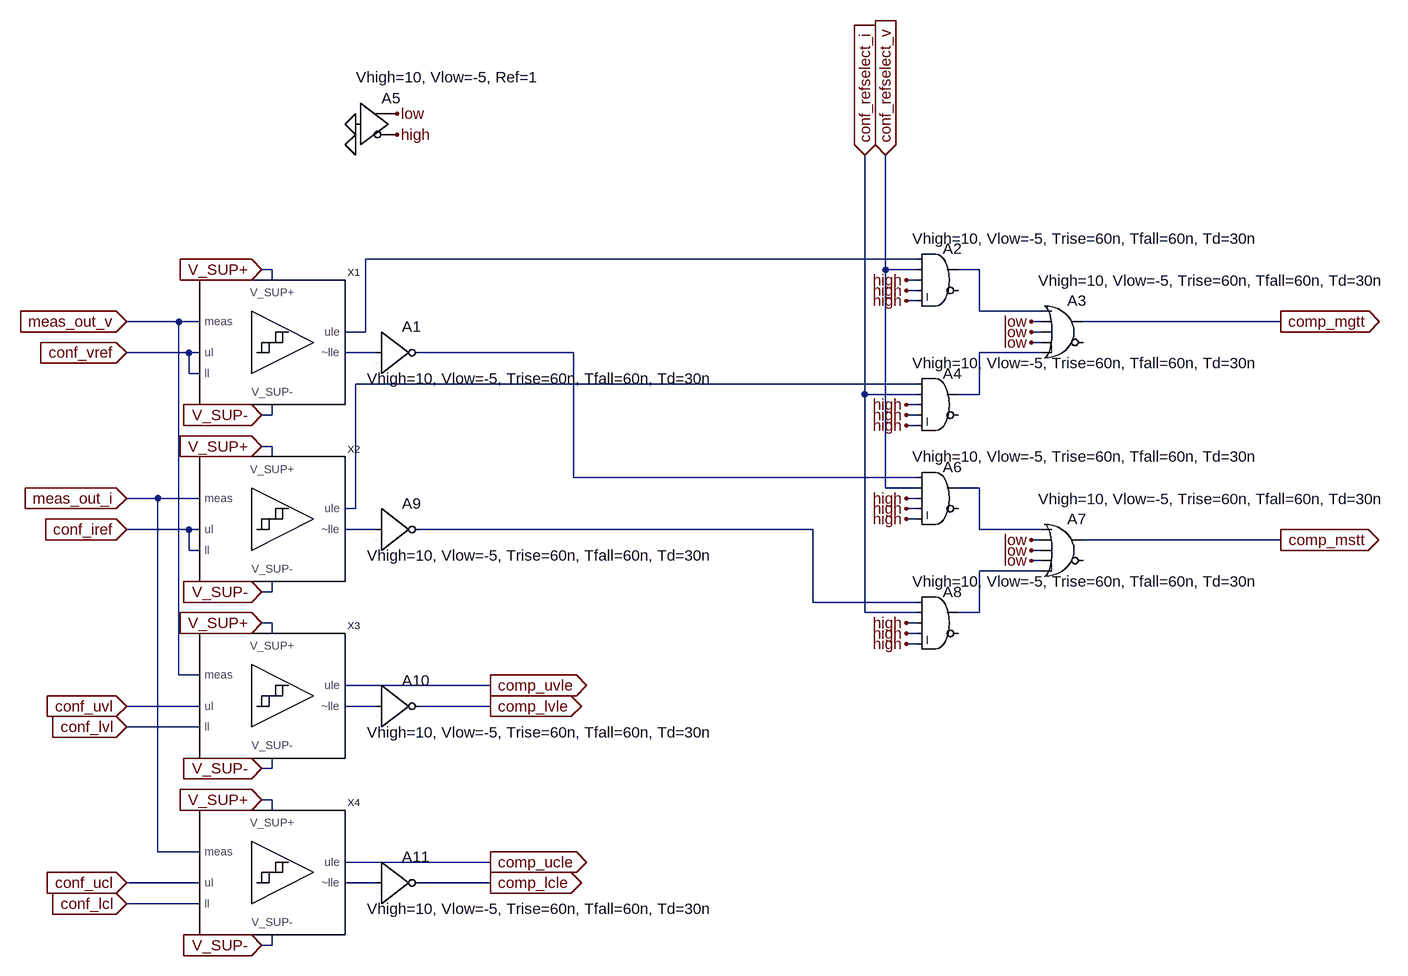
[diagram p0: schematic compare-logic.asc]
compare-logic.asc, the LTspice schematic file:
Version 4
SHEET 1 1856 856
WIRE 960 -272 112 -272
WIRE -32 -256 -48 -256
WIRE 912 -256 912 -432
WIRE 960 -256 912 -256
WIRE 1056 -256 1024 -256
WIRE -32 -240 -32 -256
WIRE 960 -240 944 -240
WIRE 960 -224 944 -224
WIRE 960 -208 944 -208
WIRE 1056 -192 1056 -256
WIRE 1152 -192 1056 -192
WIRE -176 -176 -256 -176
WIRE -144 -176 -176 -176
WIRE 1152 -176 1136 -176
WIRE 1520 -176 1216 -176
WIRE 112 -160 112 -272
WIRE 112 -160 80 -160
WIRE 1152 -160 1136 -160
WIRE 1152 -144 1136 -144
WIRE -160 -128 -256 -128
WIRE -144 -128 -160 -128
WIRE 128 -128 80 -128
WIRE 432 -128 192 -128
WIRE 1152 -128 1056 -128
WIRE -160 -96 -160 -128
WIRE -144 -96 -160 -96
WIRE 960 -80 96 -80
WIRE 880 -64 880 -432
WIRE 960 -64 880 -64
WIRE 1056 -64 1056 -128
WIRE 1056 -64 1024 -64
WIRE 960 -48 944 -48
WIRE -32 -32 -32 -48
WIRE -32 -32 -48 -32
WIRE 960 -32 944 -32
WIRE 960 -16 944 -16
WIRE -32 16 -48 16
WIRE -32 32 -32 16
WIRE 432 64 432 -128
WIRE 960 64 432 64
WIRE 912 80 912 -256
WIRE 960 80 912 80
WIRE 1056 80 1024 80
WIRE -208 96 -256 96
WIRE -144 96 -208 96
WIRE 960 96 944 96
WIRE 96 112 96 -80
WIRE 96 112 80 112
WIRE 960 112 944 112
WIRE 960 128 944 128
WIRE -160 144 -256 144
WIRE -144 144 -160 144
WIRE 128 144 80 144
WIRE 800 144 192 144
WIRE 1056 144 1056 80
WIRE 1152 144 1056 144
WIRE 1152 160 1136 160
WIRE 1520 160 1216 160
WIRE -160 176 -160 144
WIRE -144 176 -160 176
WIRE 1152 176 1136 176
WIRE 1152 192 1136 192
WIRE 1152 208 1056 208
WIRE -32 240 -32 224
WIRE -32 240 -48 240
WIRE 800 256 800 144
WIRE 960 256 800 256
WIRE 880 272 880 -64
WIRE 960 272 880 272
WIRE 1056 272 1056 208
WIRE 1056 272 1024 272
WIRE -32 288 -48 288
WIRE 960 288 944 288
WIRE -32 304 -32 288
WIRE 960 304 944 304
WIRE 960 320 944 320
WIRE -176 368 -176 -176
WIRE -144 368 -176 368
WIRE 304 384 80 384
WIRE -144 416 -256 416
WIRE 128 416 80 416
WIRE 304 416 192 416
WIRE -144 448 -256 448
WIRE -32 512 -32 496
WIRE -32 512 -48 512
WIRE -32 560 -48 560
WIRE -32 576 -32 560
WIRE -208 640 -208 96
WIRE -144 640 -208 640
WIRE 304 656 80 656
WIRE -144 688 -256 688
WIRE 128 688 80 688
WIRE 304 688 192 688
WIRE -144 720 -256 720
WIRE -32 784 -32 768
WIRE -32 784 -48 784
FLAG 96 -448 0
FLAG 96 -480 0
FLAG 160 -464 high
FLAG 160 -496 low
FLAG 944 -240 high
FLAG 944 -224 high
FLAG 944 -208 high
FLAG 1136 -160 low
FLAG 1136 -144 low
FLAG 1136 -176 low
FLAG 944 -48 high
FLAG 944 -32 high
FLAG 944 -16 high
FLAG 912 -432 conf_refselect_v
IOPIN 912 -432 In
FLAG 880 -432 conf_refselect_i
IOPIN 880 -432 In
FLAG 944 96 high
FLAG 944 112 high
FLAG 944 128 high
FLAG 1136 176 low
FLAG 1136 192 low
FLAG 1136 160 low
FLAG 944 288 high
FLAG 944 304 high
FLAG 944 320 high
FLAG -48 -256 V_SUP+
IOPIN -48 -256 In
FLAG -48 -32 V_SUP-
IOPIN -48 -32 In
FLAG -48 16 V_SUP+
IOPIN -48 16 In
FLAG -48 240 V_SUP-
IOPIN -48 240 In
FLAG -48 288 V_SUP+
IOPIN -48 288 In
FLAG -48 512 V_SUP-
IOPIN -48 512 In
FLAG -48 560 V_SUP+
IOPIN -48 560 In
FLAG -48 784 V_SUP-
IOPIN -48 784 In
FLAG 1520 -176 comp_mgtt
IOPIN 1520 -176 Out
FLAG 1520 160 comp_mstt
IOPIN 1520 160 Out
FLAG 304 384 comp_uvle
IOPIN 304 384 Out
FLAG 304 416 comp_lvle
IOPIN 304 416 Out
FLAG 304 656 comp_ucle
IOPIN 304 656 Out
FLAG 304 688 comp_lcle
IOPIN 304 688 Out
FLAG -256 -176 meas_out_v
IOPIN -256 -176 In
FLAG -256 96 meas_out_i
IOPIN -256 96 In
FLAG -256 -128 conf_vref
IOPIN -256 -128 In
FLAG -256 144 conf_iref
IOPIN -256 144 In
FLAG -256 416 conf_uvl
IOPIN -256 416 In
FLAG -256 448 conf_lvl
IOPIN -256 448 In
FLAG -256 688 conf_ucl
IOPIN -256 688 In
FLAG -256 720 conf_lcl
IOPIN -256 720 In
SYMBOL window-comparator -32 -144 R0
SYMATTR InstName X1
SYMBOL Digital\\inv 128 -192 R0
WINDOW 39 -14 104 Left 2
SYMATTR InstName A1
SYMATTR SpiceLine Vhigh=10, Vlow=-5, Trise=60n, Tfall=60n, Td=30n
SYMBOL Digital\\and 992 -304 R0
WINDOW 39 -39 0 Left 2
SYMATTR InstName A2
SYMATTR SpiceLine Vhigh=10, Vlow=-5, Trise=60n, Tfall=60n, Td=30n
SYMBOL Digital\\or 1184 -224 R0
WINDOW 39 -37 -15 Left 2
SYMATTR InstName A3
SYMATTR SpiceLine Vhigh=10, Vlow=-5, Trise=60n, Tfall=60n, Td=30n
SYMBOL Digital\\buf 96 -544 R0
WINDOW 39 1 -8 Left 2
SYMATTR InstName A5
SYMATTR SpiceLine Vhigh=10, Vlow=-5, Ref=1
SYMBOL Digital\\and 992 -112 R0
WINDOW 39 -39 0 Left 2
SYMATTR InstName A4
SYMATTR SpiceLine Vhigh=10, Vlow=-5, Trise=60n, Tfall=60n, Td=30n
SYMBOL Digital\\and 992 32 R0
WINDOW 39 -39 0 Left 2
SYMATTR InstName A6
SYMATTR SpiceLine Vhigh=10, Vlow=-5, Trise=60n, Tfall=60n, Td=30n
SYMBOL Digital\\or 1184 112 R0
WINDOW 39 -37 -15 Left 2
SYMATTR InstName A7
SYMATTR SpiceLine Vhigh=10, Vlow=-5, Trise=60n, Tfall=60n, Td=30n
SYMBOL Digital\\and 992 224 R0
WINDOW 39 -39 0 Left 2
SYMATTR InstName A8
SYMATTR SpiceLine Vhigh=10, Vlow=-5, Trise=60n, Tfall=60n, Td=30n
SYMBOL window-comparator -32 128 R0
SYMATTR InstName X2
SYMBOL Digital\\inv 128 80 R0
WINDOW 39 -14 104 Left 2
SYMATTR InstName A9
SYMATTR SpiceLine Vhigh=10, Vlow=-5, Trise=60n, Tfall=60n, Td=30n
SYMBOL window-comparator -32 400 R0
SYMATTR InstName X3
SYMBOL Digital\\inv 128 352 R0
WINDOW 39 -14 104 Left 2
SYMATTR InstName A10
SYMATTR SpiceLine Vhigh=10, Vlow=-5, Trise=60n, Tfall=60n, Td=30n
SYMBOL window-comparator -32 672 R0
SYMATTR InstName X4
SYMBOL Digital\\inv 128 624 R0
WINDOW 39 -14 104 Left 2
SYMATTR InstName A11
SYMATTR SpiceLine Vhigh=10, Vlow=-5, Trise=60n, Tfall=60n, Td=30n

The netlist it stands for:
* compare-logic.asc
XX1 V_SUP+ V_SUP- conf_vref conf_vref meas_out_v N001 N003 window-comparator  ; pins V_SUP+ V_SUP- ul ll meas ule ~lle
A1 N003 0 0 0 0 N004 0 0 BUF Vhigh=10, Vlow=-5, Trise=60n, Tfall=60n, Td=30n
A2 N001 conf_refselect_v high high high 0 N002 0 AND Vhigh=10, Vlow=-5, Trise=60n, Tfall=60n, Td=30n
A3 N002 low low low N005 0 comp_mgtt 0 OR Vhigh=10, Vlow=-5, Trise=60n, Tfall=60n, Td=30n
A5 0 0 0 0 0 high low 0 BUF Vhigh=10, Vlow=-5, Ref=1
A4 N006 conf_refselect_i high high high 0 N005 0 AND Vhigh=10, Vlow=-5, Trise=60n, Tfall=60n, Td=30n
A6 N004 conf_refselect_v high high high 0 N007 0 AND Vhigh=10, Vlow=-5, Trise=60n, Tfall=60n, Td=30n
A7 N007 low low low N010 0 comp_mstt 0 OR Vhigh=10, Vlow=-5, Trise=60n, Tfall=60n, Td=30n
A8 N009 conf_refselect_i high high high 0 N010 0 AND Vhigh=10, Vlow=-5, Trise=60n, Tfall=60n, Td=30n
XX2 V_SUP+ V_SUP- conf_iref conf_iref meas_out_i N006 N008 window-comparator  ; pins V_SUP+ V_SUP- ul ll meas ule ~lle
A9 N008 0 0 0 0 N009 0 0 BUF Vhigh=10, Vlow=-5, Trise=60n, Tfall=60n, Td=30n
XX3 V_SUP+ V_SUP- conf_uvl conf_lvl meas_out_v comp_uvle N011 window-comparator  ; pins V_SUP+ V_SUP- ul ll meas ule ~lle
A10 N011 0 0 0 0 comp_lvle 0 0 BUF Vhigh=10, Vlow=-5, Trise=60n, Tfall=60n, Td=30n
XX4 V_SUP+ V_SUP- conf_ucl conf_lcl meas_out_i comp_ucle N012 window-comparator  ; pins V_SUP+ V_SUP- ul ll meas ule ~lle
A11 N012 0 0 0 0 comp_lcle 0 0 BUF Vhigh=10, Vlow=-5, Trise=60n, Tfall=60n, Td=30n
.backanno
.end